# EAGLE design CAN Mirror_backup_NOTCURRENT (EAGLE 5.12)
PARTNO: SDR0604-180YL

## Sheet 1 of 3
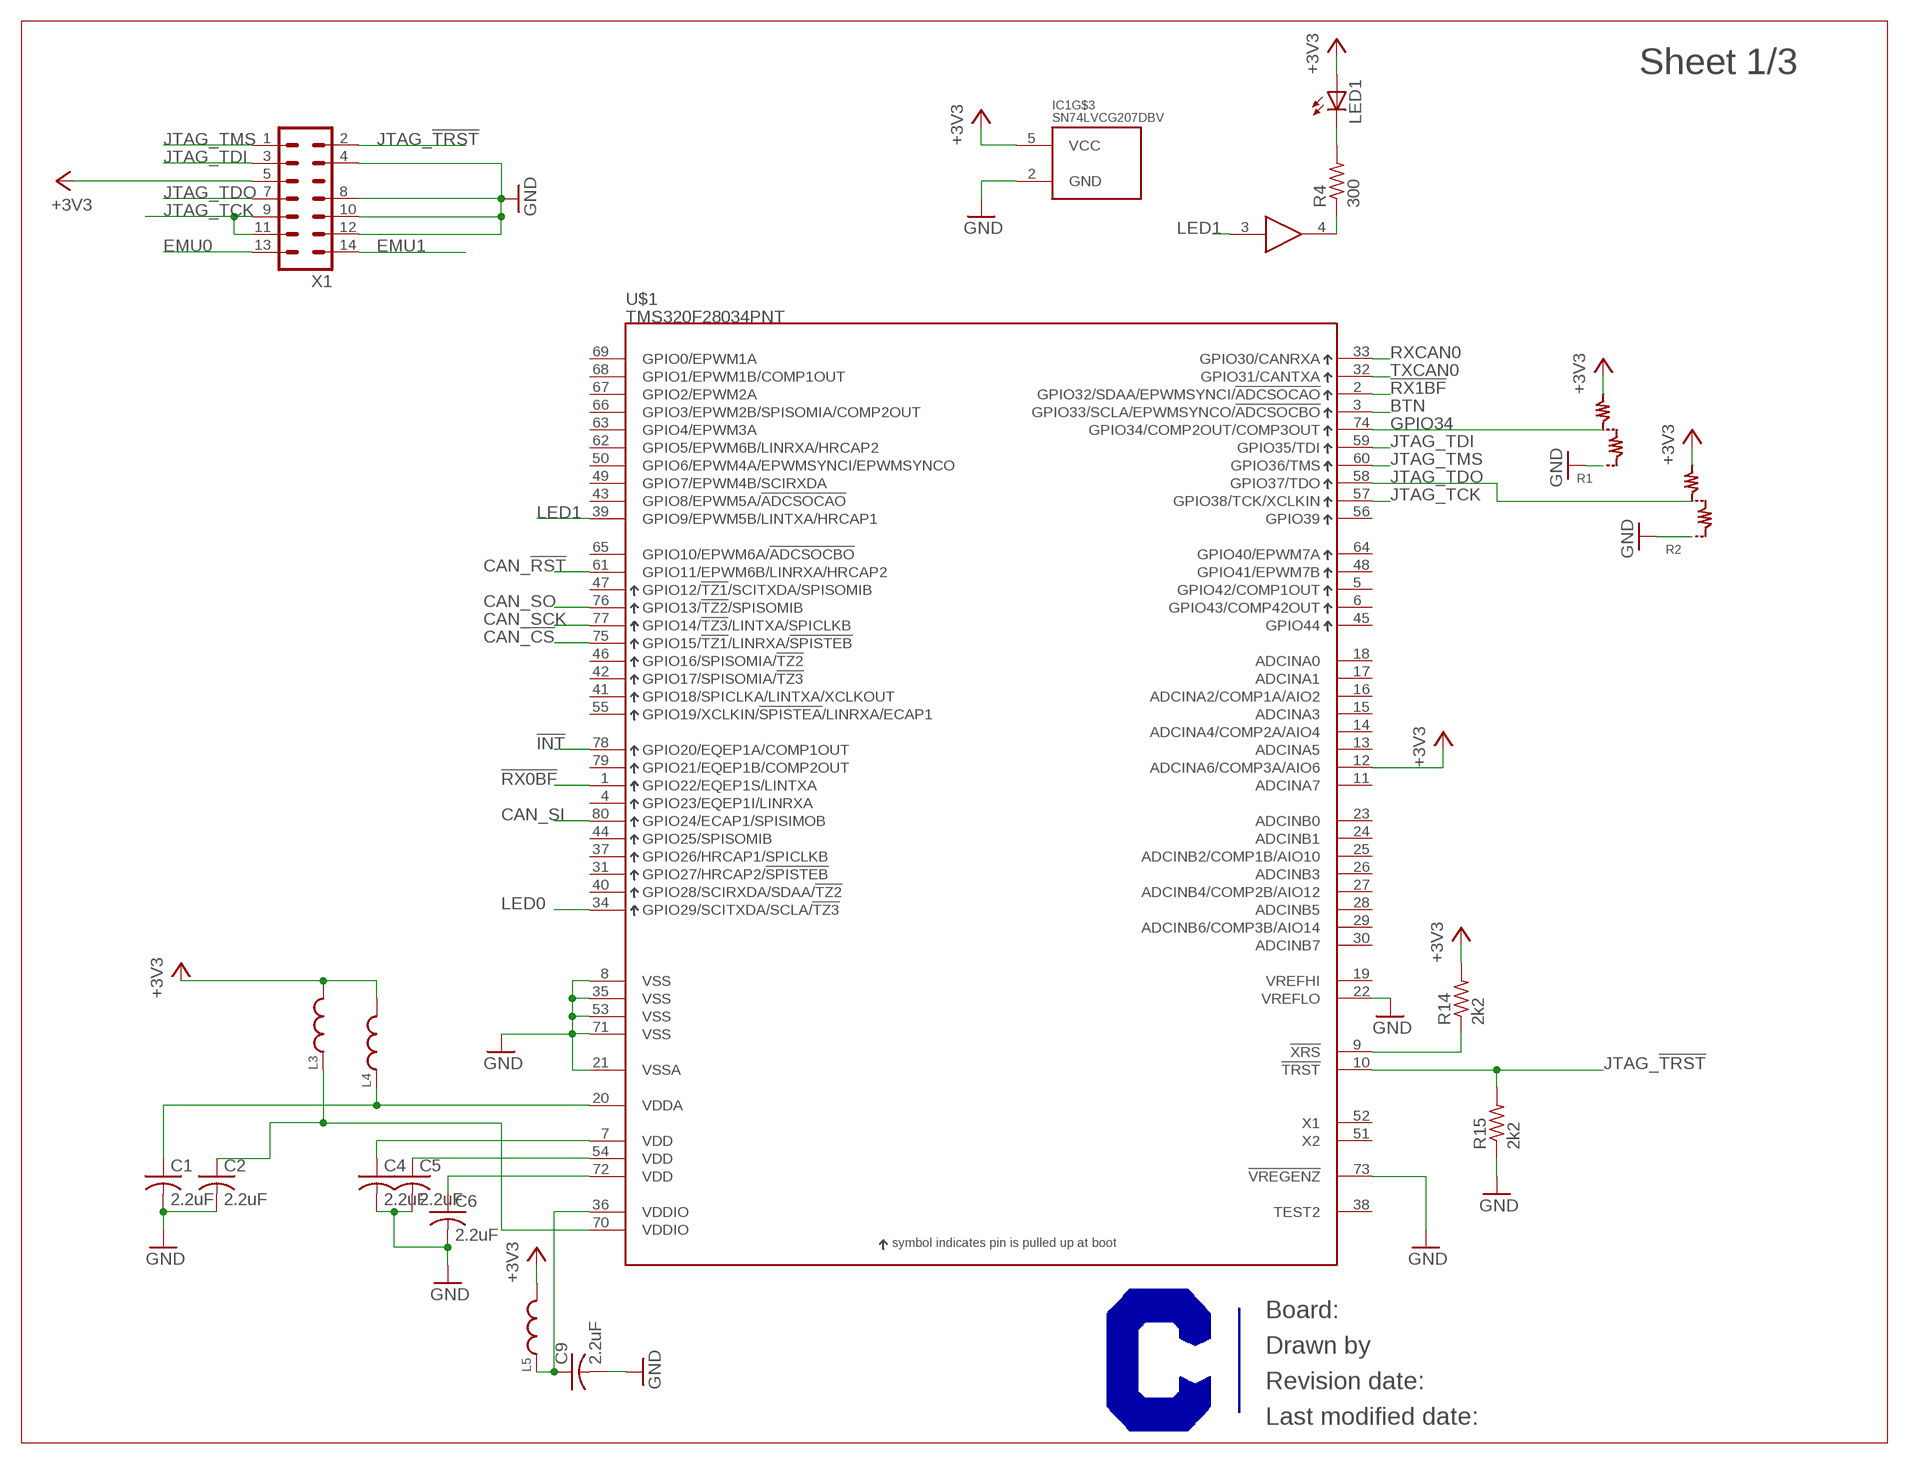
[diagram p0: schematic, sheet 1]

### Parts
C1  2.2uF  C-USC0603  [C0603]
C2  2.2uF  C-USC0603  [C0603]
C4  2.2uF  C-USC0603  [C0603]
C5  2.2uF  C-USC0603  [C0603]
C6  2.2uF  C-USC0603  [C0603]
C9  2.2uF  C-USC0603  [C0603]
IC1  SN74LVCG207DBV  [DBV_(R-PDSO-G6)]
L3  INDUCTOR  [0603]
L4  INDUCTOR  [0603]
L5  INDUCTOR  [0603]
LED1  SMS1105  [SMS1105]
R1  0402-JUMPER-3WAY-0603  [0603-JUMPER-3WAY]
R2  0402-JUMPER-3WAY-0603  [0603-JUMPER-3WAY]
R4  300  R-US_R0603  [R0603]
R14  2k2  R-US_R0603  [R0603]
R15  2k2  R-US_R0603  [R0603]
U$1  TMS320F28034PNT  [PQFP-80_(S-PQFP-G80)]
U$2  CURRENT-C-LETTER-LANDSCAPE  [BLANK]
X1  JTAG_HEADER  [TI_JTAG_HEADER]

### Nets
!INT: U$1.78(GPIO20/EQEP1A/COMP1OUT) ; also sheet 2
!RX0BF: U$1.1(GPIO22/EQEP1S/LINTXA) ; also sheet 2
!RX1BF: U$1.2(GPIO32/SDAA/EPWMSYNCI/!ADCSOCAO) ; also sheet 2
+3V3: IC1.5(VCC) L3.B L4.B L5.B LED1.ANODE(A) R1.B R2.B R14.2 U$1.12(ADCINA6/COMP3A/AIO6) X1.5(VTREF) ; also sheet 2,3
BTN: U$1.3(GPIO33/SCLA/EPWMSYNCO/!ADCSOCBO)
CAN_!CS: U$1.75(GPIO15/!TZ1!/LINRXA/!SPISTEB)
CAN_!RST: U$1.61(GPIO11/EPWM6B/LINRXA/HRCAP2)
CAN_SCK: U$1.77(GPIO14/!TZ3!/LINTXA/SPICLKB)
CAN_SI: U$1.80(GPIO24/ECAP1/SPISIMOB)
CAN_SO: U$1.76(GPIO13/!TZ2!/SPISOMIB)
EMU0: X1.13(EMU0)
EMU1: X1.14(EMU1)
GND: C1.2 C2.2 C4.2 C5.2 C6.2 C9.2 IC1.2(GND) R1.C R2.C R15.1 U$1.8(VSS) U$1.21(VSSA) U$1.22(VREFLO) U$1.35(VSS) U$1.53(VSS) U$1.71(VSS) U$1.73(!VREGENZ) X1.4(GND) X1.8(GND) X1.10(GND) X1.12(GND) ; also sheet 2,3
GPIO34: R1.A U$1.74(GPIO34/COMP2OUT/COMP3OUT)
JTAG_!TRST: R15.2 U$1.10(!TRST) X1.2(!TRST)
JTAG_TCK: U$1.57(GPIO38/TCK/XCLKIN) X1.9(TCK) X1.11
JTAG_TDI: U$1.59(GPIO35/TDI) X1.3(TDI)
JTAG_TDO: R2.A U$1.58(GPIO37/TDO) X1.7(TDO)
JTAG_TMS: U$1.60(GPIO36/TMS) X1.1(TMS)
LED0: U$1.34(GPIO29/SCITXDA/SCLA/!TZ3)
LED1: IC1.3(A) U$1.39(GPIO9/EPWM5B/LINTXA/HRCAP1)
N$1: R14.1 U$1.9(!XRS)
N$2: C1.1 L4.A U$1.20(VDDA)
N$3: C2.1 L3.A U$1.70(VDDIO)
N$4: IC1.4(Y) R4.1
N$5: C6.1 U$1.72(VDD)
N$6: C5.1 U$1.54(VDD)
N$7: C4.1 U$1.7(VDD)
N$9: LED1.CATHODE(C) R4.2
N$10: C9.1 L5.A U$1.36(VDDIO)
RXCAN0: U$1.33(GPIO30/CANRXA) ; also sheet 2
TXCAN0: U$1.32(GPIO31/CANTXA) ; also sheet 2
Unconnected: IC1.1(A) IC1.6(Y) U$1.4(GPIO23/EQEP1I/LINRXA) U$1.5(GPIO42/COMP1OUT) U$1.6(GPIO43/COMP42OUT) U$1.11(ADCINA7) U$1.13(ADCINA5) U$1.14(ADCINA4/COMP2A/AIO4) U$1.15(ADCINA3) U$1.16(ADCINA2/COMP1A/AIO2) U$1.17(ADCINA1) U$1.18(ADCINA0) U$1.19(VREFHI) U$1.23(ADCINB0) U$1.24(ADCINB1) U$1.25(ADCINB2/COMP1B/AIO10) U$1.26(ADCINB3) U$1.27(ADCINB4/COMP2B/AIO12) U$1.28(ADCINB5) U$1.29(ADCINB6/COMP3B/AIO14) U$1.30(ADCINB7) U$1.31(GPIO27/HRCAP2/!SPISTEB) U$1.37(GPIO26/HRCAP1/SPICLKB) U$1.38(TEST2) U$1.40(GPIO28/SCIRXDA/SDAA/!TZ2) U$1.41(GPIO18/SPICLKA/LINTXA/XCLKOUT) U$1.42(GPIO17/SPISOMIA/!TZ3) U$1.43(GPIO8/EPWM5A/!ADCSOCAO) U$1.44(GPIO25/SPISOMIB) U$1.45(GPIO44) U$1.46(GPIO16/SPISOMIA/!TZ2) U$1.47(GPIO12/!TZ1!/SCITXDA/SPISOMIB) U$1.48(GPIO41/EPWM7B) U$1.49(GPIO7/EPWM4B/SCIRXDA) U$1.50(GPIO6/EPWM4A/EPWMSYNCI/EPWMSYNCO) U$1.51(X2) U$1.52(X1) U$1.55(GPIO19/XCLKIN/!SPISTEA!/LINRXA/ECAP1) U$1.56(GPIO39) U$1.62(GPIO5/EPWM6B/LINRXA/HRCAP2) U$1.63(GPIO4/EPWM3A) U$1.64(GPIO40/EPWM7A) U$1.65(GPIO10/EPWM6A/!ADCSOCBO) U$1.66(GPIO3/EPWM2B/SPISOMIA/COMP2OUT) U$1.67(GPIO2/EPWM2A) U$1.68(GPIO1/EPWM1B/COMP1OUT) U$1.69(GPIO0/EPWM1A) U$1.79(GPIO21/EQEP1B/COMP2OUT)

## Sheet 2 of 3
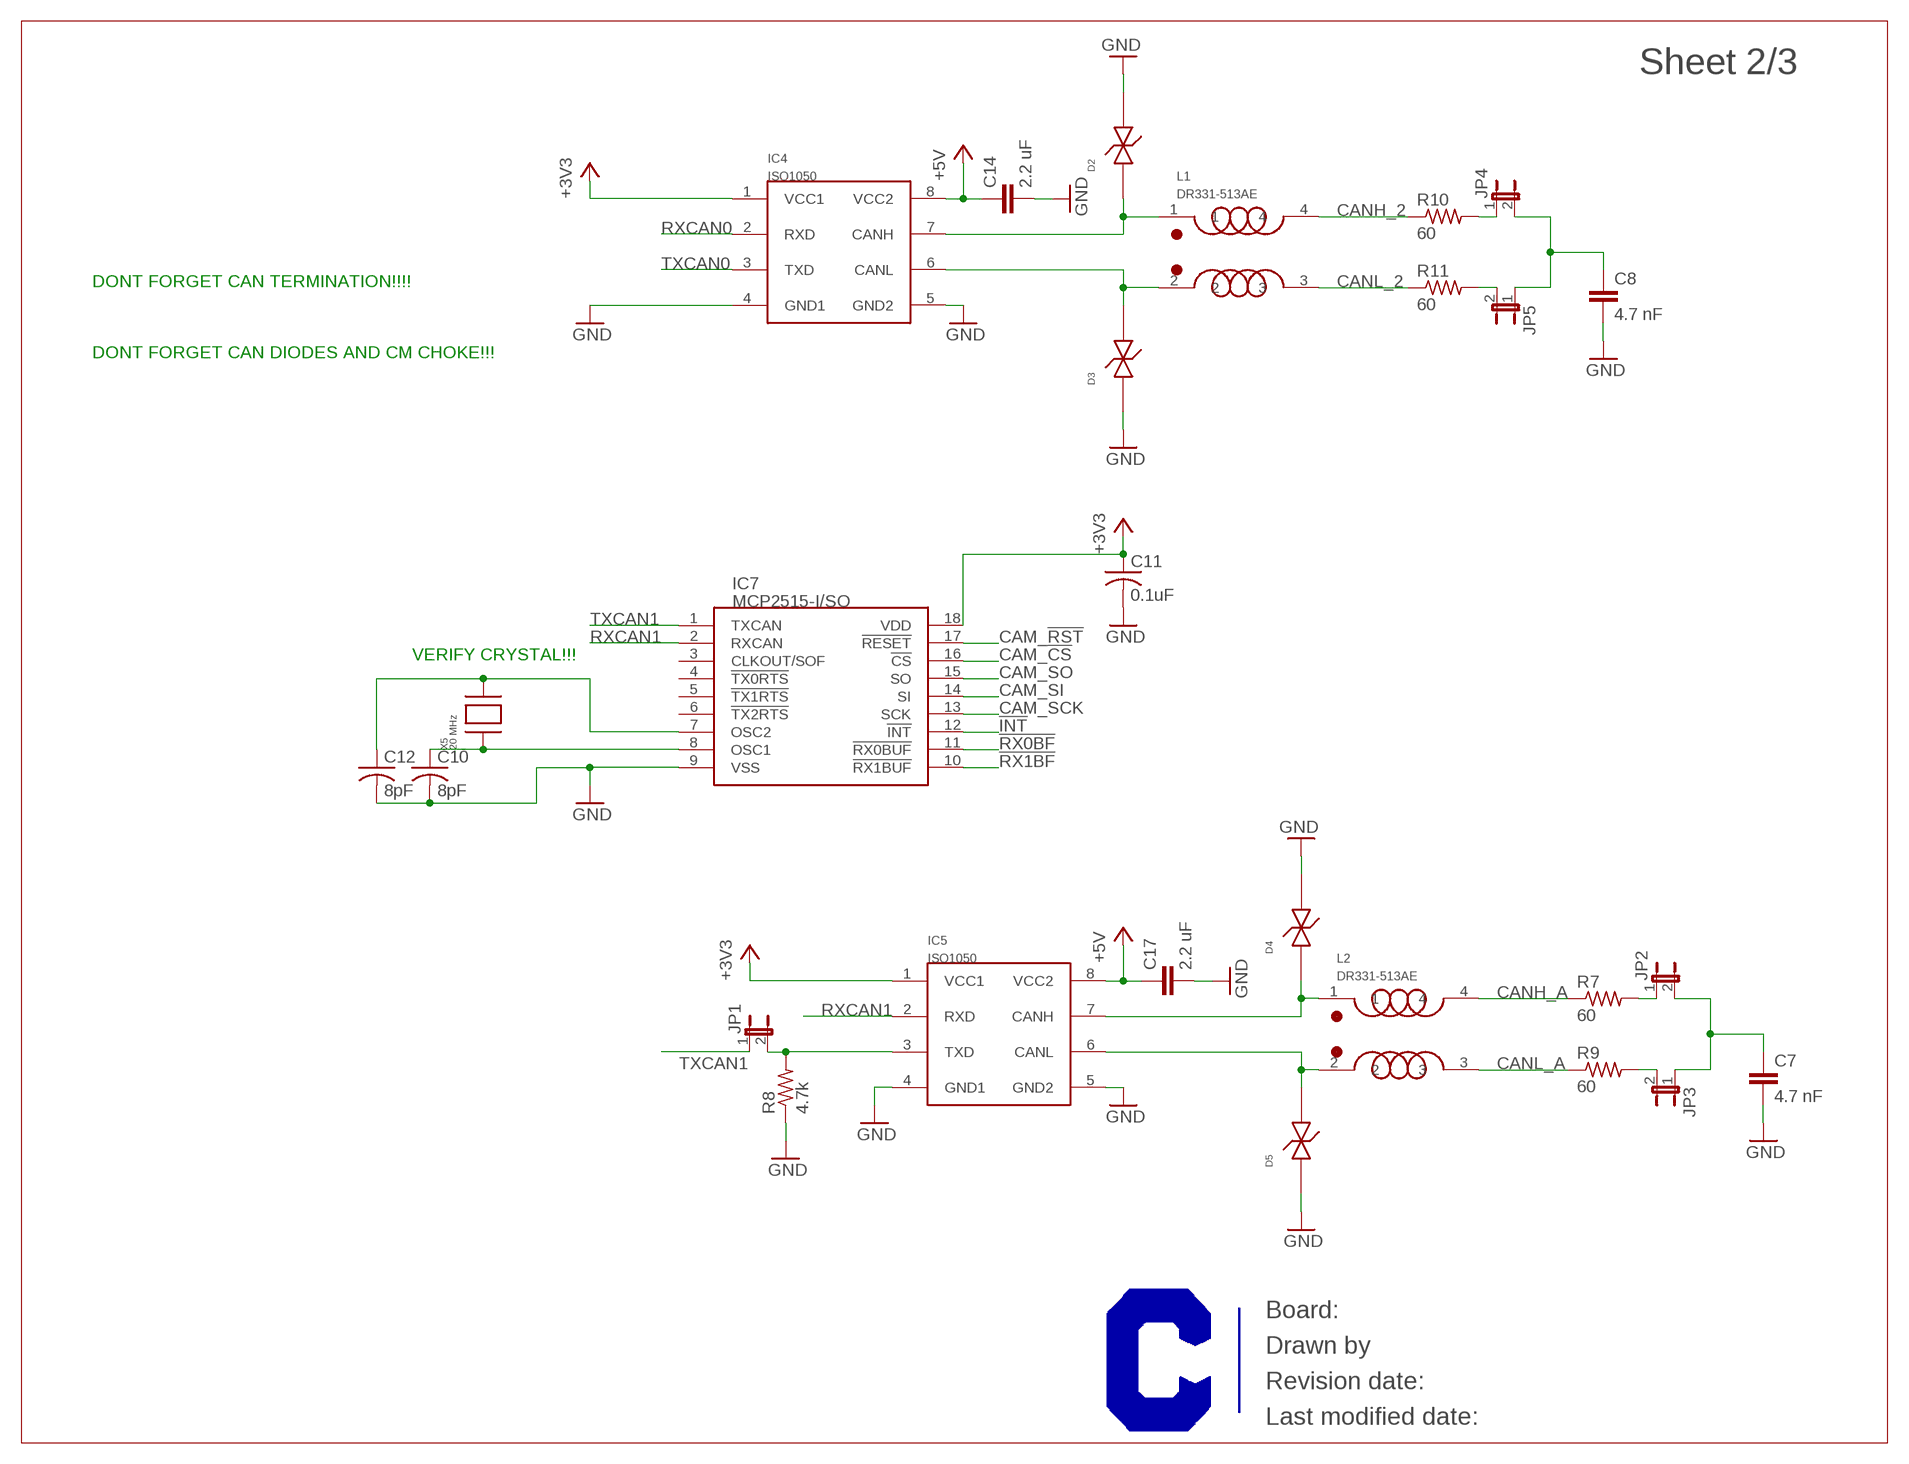
[diagram p1: schematic, sheet 2]

### Parts
C7  4.7 nF  C-EUC0603  [C0603]
C8  4.7 nF  C-EUC0603  [C0603]
C10  8pF  C-USC0603  [C0603]
C11  0.1uF  C-USC0603  [C0603]
C12  8pF  C-USC0603  [C0603]
C14  2.2 uF  C-EUC0603  [C0603]
C17  2.2 uF  C-EUC0603  [C0603]
D2  SMBJ30CA  [DO-214AA]
D3  SMBJ30CA  [DO-214AA]
D4  SMBJ30CA  [DO-214AA]
D5  SMBJ30CA  [DO-214AA]
IC4  ISO1050  [DUB_(R-PDSO-G8)]
IC5  ISO1050  [DUB_(R-PDSO-G8)]
IC7  MCP2515-I/SO  [SOIC18]
JP1  JP1E  [JP1]
JP2  JP1E  [JP1]
JP3  JP1E  [JP1]
JP4  JP1E  [JP1]
JP5  JP1E  [JP1]
L1  DR331-513AE  [SMD]
L2  DR331-513AE  [SMD]
R7  60  R-US_R0603  [R0603]
R8  4.7k  R-US_R0603  [R0603]
R9  60  R-US_R0603  [R0603]
R10  60  R-US_R0603  [R0603]
R11  60  R-US_R0603  [R0603]
U$5  CURRENT-C-LETTER-LANDSCAPE  [BLANK]
X5  20 MHz  ECX53B  [ECX-53B]

### Nets
!INT: IC7.12(!INT) ; also sheet 1
!RX0BF: IC7.11(!RX0BUF) ; also sheet 1
!RX1BF: IC7.10(!RX1BUF) ; also sheet 1
+3V3: C11.1 IC4.1(VCC1) IC5.1(VCC1) IC7.18(VDD) ; also sheet 1,3
+5V: C14.1 C17.1 IC4.8(VCC2) IC5.8(VCC2) ; also sheet 3
CAM_!CS: IC7.16(!CS)
CAM_!RST: IC7.17(!RESET)
CAM_SCK: IC7.13(SCK)
CAM_SI: IC7.14(SI)
CAM_SO: IC7.15(SO)
CANH_2: L1.4 R10.1 ; also sheet 3
CANH_2_NF: D2.1 IC4.7(CANH) L1.1
CANH_A: L2.4 R7.1 ; also sheet 3
CANH_A_NF: D4.1 IC5.7(CANH) L2.1
CANL_2: L1.3 R11.1 ; also sheet 3
CANL_2_NF: D3.2 IC4.6(CANL) L1.2
CANL_A: L2.3 R9.1 ; also sheet 3
CANL_A_NF: D5.2 IC5.6(CANL) L2.2
GND: C7.2 C8.2 C10.2 C11.2 C12.2 C14.2 C17.2 D2.2 D3.1 D4.2 D5.1 IC4.4(GND1) IC4.5(GND2) IC5.4(GND1) IC5.5(GND2) IC7.9(VSS) R8.1 ; also sheet 1,3
N$12: JP2.1 R7.2
N$13: JP3.2 R9.2
N$14: C7.1 JP2.2 JP3.1
N$15: JP4.1 R10.2
N$16: JP5.2 R11.2
N$17: C8.1 JP4.2 JP5.1
N$24: C10.1 IC7.8(OSC1) X5.1
N$25: C12.1 IC7.7(OSC2) X5.3
RXCAN0: IC4.2(RXD) ; also sheet 1
RXCAN1: IC5.2(RXD) IC7.2(RXCAN)
TXCAN0: IC4.3(TXD) ; also sheet 1
TXCAN1: IC7.1(TXCAN) JP1.1
TXCAN_NJ: IC5.3(TXD) JP1.2 R8.2
Unconnected: IC7.3(CLKOUT/SOF) IC7.4(!TX0RTS) IC7.5(!TX1RTS) IC7.6(!TX2RTS)

### Notes on the sheet
- DONT FORGET CAN TERMINATION!!!!
- DONT FORGET CAN DIODES AND CM CHOKE!!!
- VERIFY CRYSTAL!!!

## Sheet 3 of 3
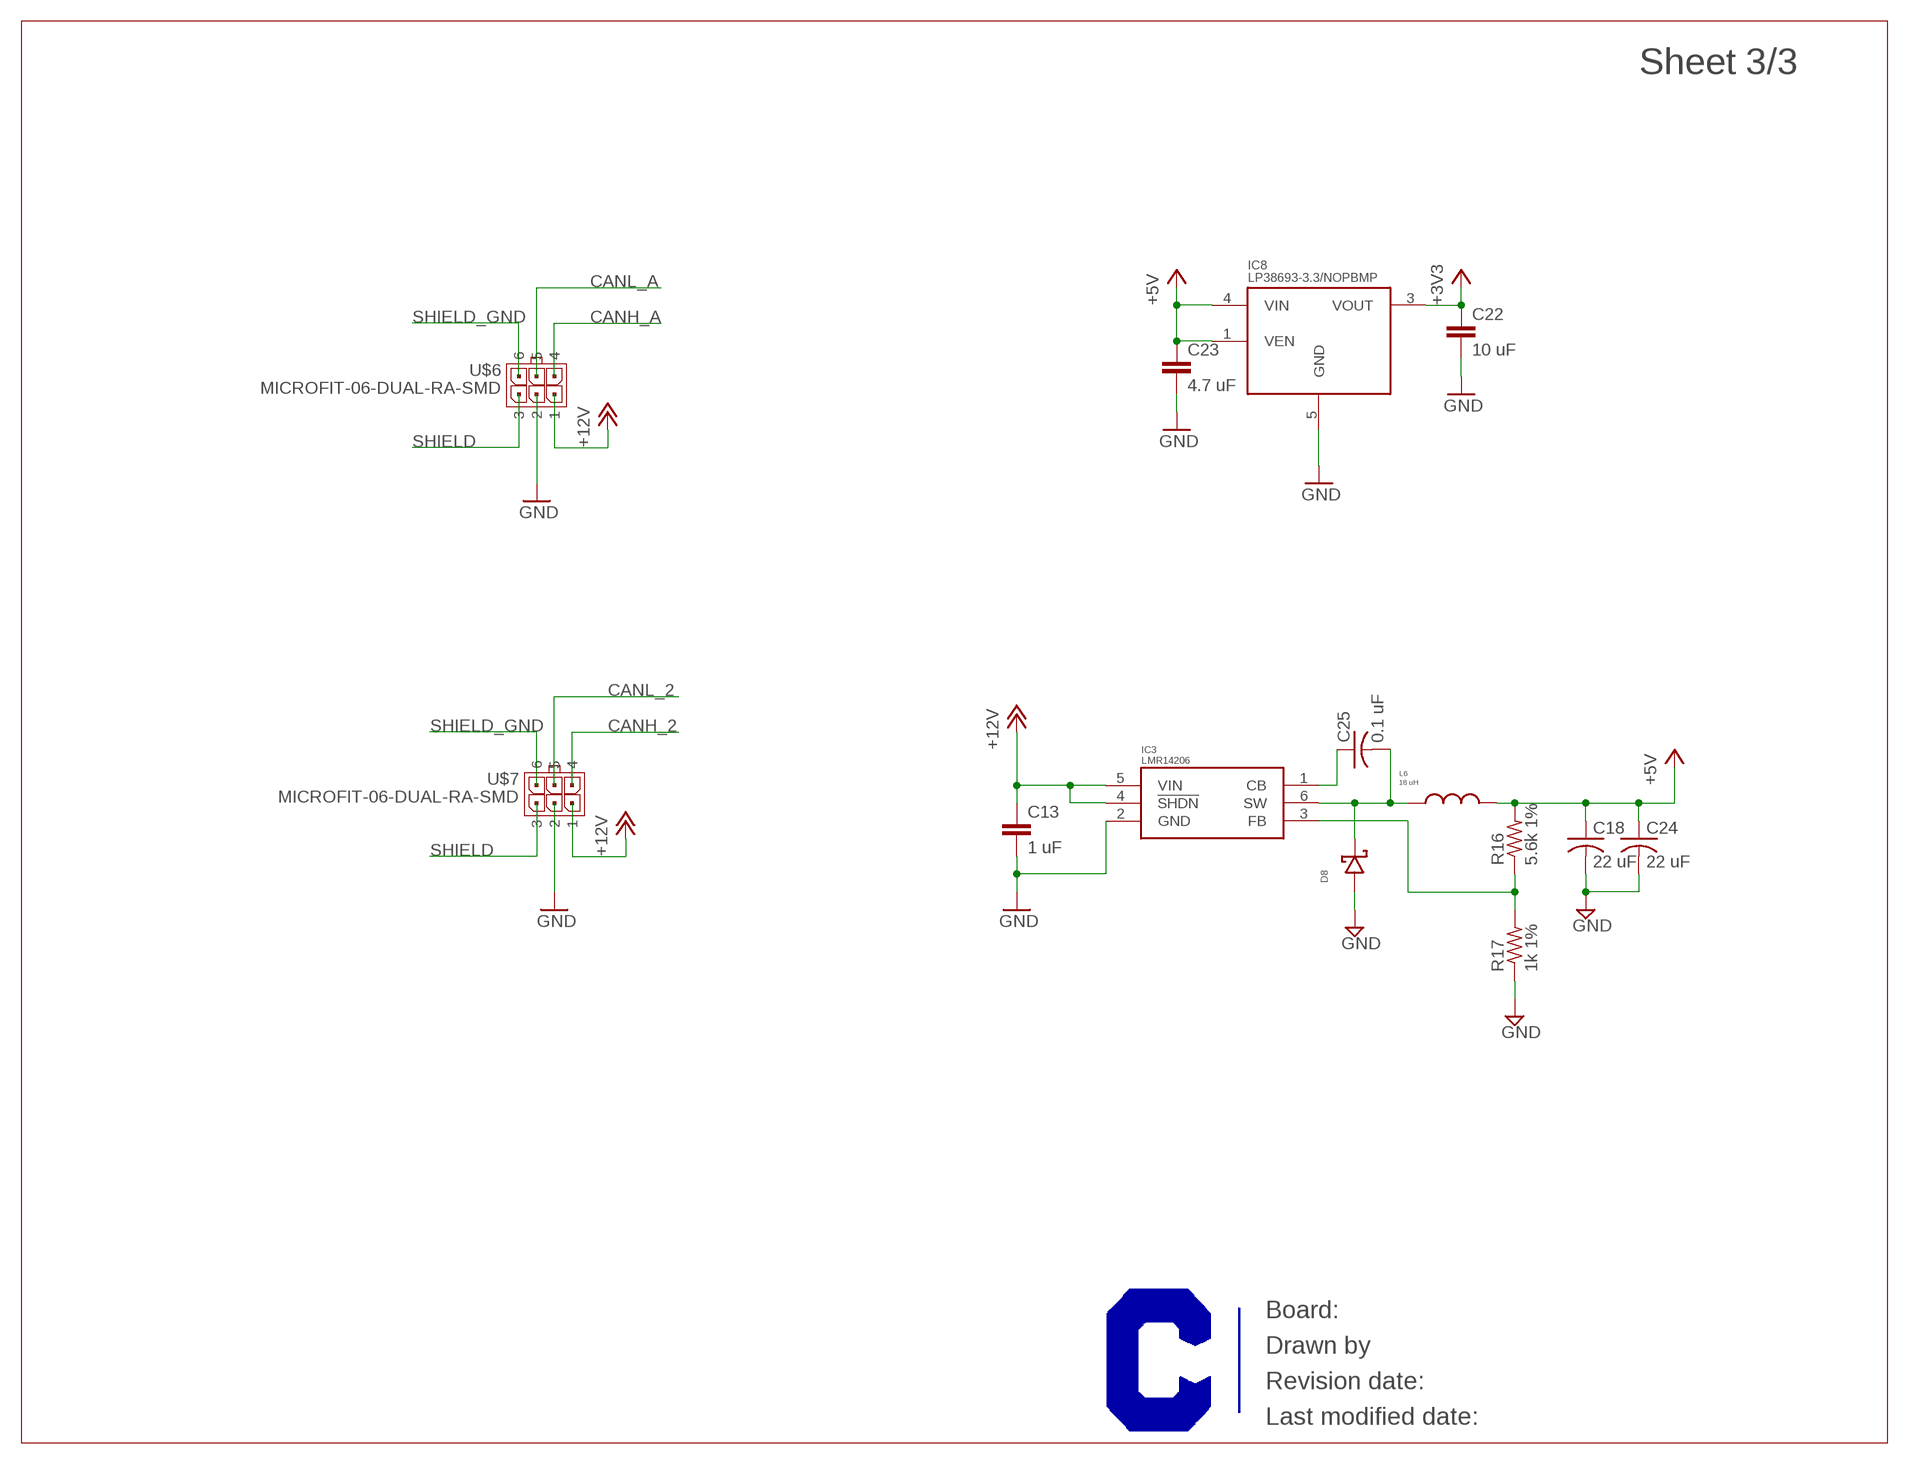
[diagram p2: schematic, sheet 3]

### Parts
C13  1 uF  C-EUC1206  [C1206]
C18  22 uF  C-USC0805  [C0805]
C22  10 uF  C-EUC0603  [C0603]
C23  4.7 uF  C-EUC0603  [C0603]
C24  22 uF  C-USC0805  [C0805]
C25  0.1 uF  C-USC0603  [C0603]
D8  SCHOTTKY_DIODE-SMA  [SMA]
IC3  LMR14206  [SOT-6_DDC]
IC8  LP38693-3.3/NOPBMP  [SOT-223-5]
L6  18 uH  VLP8040T  [VLP8040]
R16  5.6k 1%  R-US_R0603  [R0603]
R17  1k 1%  R-US_R0603  [R0603]
U$3  CURRENT-C-LETTER-LANDSCAPE  [BLANK]
U$6  MICROFIT-06-DUAL-RA-SMD  [MICROFIT-6-DUAL-RA-SMD]
U$7  MICROFIT-06-DUAL-RA-SMD  [MICROFIT-6-DUAL-RA-SMD]

### Nets
+3V3: C22.1 IC8.3(VOUT) ; also sheet 1,2
+5V: C18.1 C23.1 C24.1 IC8.1(VEN) IC8.4(VIN) L6.2 R16.2 ; also sheet 2
+12V: C13.1 IC3.4(!SHDN) IC3.5(VIN) U$6.6 U$7.6
CANH_2: U$7.1 ; also sheet 2
CANH_A: U$6.1 ; also sheet 2
CANL_2: U$7.2 ; also sheet 2
CANL_A: U$6.2 ; also sheet 2
GND: C13.2 C18.2 C22.2 C23.2 C24.2 D8.ANODE IC3.2(GND) IC8.5(GND) R17.1 U$6.5 U$7.5 ; also sheet 1,2
N$21: C25.2 D8.CATHODE IC3.6(SW) L6.1
N$22: C25.1 IC3.1(CB)
SHIELD: U$6.4 U$7.4
SHIELD_GND: U$6.3 U$7.3
VSENSE1: IC3.3(FB) R16.1 R17.2

## Library data of the parts
C1 C2 C4-C6 C9-C12 C18 C24 C25 = rcl:C-US: CAPACITOR, American symbol
C7 C8 C13 C14 C17 C22 C23 = rcl:C-EU: CAPACITOR, European symbol
D2-D5 = Littelfuse:SMBJ30CA: Bidirectional TVS Zener Diode 30V Breakdown http://www.digikey.com/product-detail/en/SMBJ30CA/SMBJ30CALFCT-ND/286112; PARTNO: SMBJ30CALFCT-ND
D8 = Diodes:SCHOTTKY_DIODE
IC1 = TI:SN74LVCG207: SN74LVC2G07: Dual Buffer/Driver with Open Drain Outputs no datasheet 4 u!!
IC3 = TI:LMR14206: LMR14206 SIMPLE SWITCHER® 42Vin, 0.6A Step-Down Voltage Regulator in SOT-23 Datasheet: http://www.ti.com/lit/ds/symlink/lmr14206.pdf
IC4 IC5 = TI:ISO1050: ISO1050 - Isolated 5V CAN Transceiver w/ 3.3V or 5V Logic http://www.ti.com/product/iso1050; PARTNO: ISO1050DUBR
IC7 = Microchip:MCP2515: Stand alone CAN controller with SPI interface; PARTNO: MCP2515-I/SO
IC8 = TI:LP38693: TI LP38693-3.3 LDO 500mA Very Low Vdo. http://www.ti.com/lit/ds/symlink/lp38693.pdf; PARTNO: LP38693MP-3.3/NOPB
JP1-JP5 = jumper:JP1E: JUMPER
L1 L2 = Bourns:DR331-513AE: Bourns Common Mode Choke; PARTNO: DR331-513AECT-ND
L3-L5 = Passives:INDUCTOR
L6 = TDK:VLP: VLP Series Shielded Wound Ferrite Inductors Datasheet: http://datasheet.octopart.com/VLP8040T-100M-TDK-datasheet-16646286.pdf
LED1 = Bivar:SMS1105: Bivar SMS1105PGC Side View Package LED Datasheet: http://datasheet.octopart.com/SMS1105PGC-Bivar-datasheet-8780798.pdf
R1 R2 = Passives:0402-JUMPER-3WAY: A 3-way solder jumper in 0402 size.
R4 R7-R11 R14-R17 = rcl:R-US_: RESISTOR, American symbol
U$1 = TI:TMS320F28034: TMS320F2803x (Piccolo) 32-Bit High-Efficiency MCU Datasheet: http://www.ti.com/lit/ds/sprs584j/sprs584j.pdf Product page: http://www.ti.com/product/tms320f28034; PARTNO: TMS320F28035PNT
U$2 U$3 U$5 = Frames:CURRENT-C-LETTER-LANDSCAPE; BOM: EXCLUDE
U$6 U$7 = Molex:MICROFIT-06-DUAL: Molex MicroFit 3.00mm Pitch Header, Surface Mount, Dual Row, 6 Circuits Molex P/N: 43045-0609 (right-angle) 43045-0618 (vertical) RA: Drawing: http://www.molex.com/pdm_docs/sd/430450609_sd.pdf (right-angle) Information: http://www.molex.com/molex/products/datasheet.jsp?part=active/0430450618_PCB_HEADERS.xml
X1 = TI:JTAG_HEADER: TI 14-pin JTAG header Reference: http://processors.wiki.ti.com/index.php/JTAG_Connectors
X5 = Crystals:ECX53B: ECX-53B SMD Quartz Crystal Datasheet: http://www.ecsxtal.com/store/pdf/ecx_53b.pdf

## Board
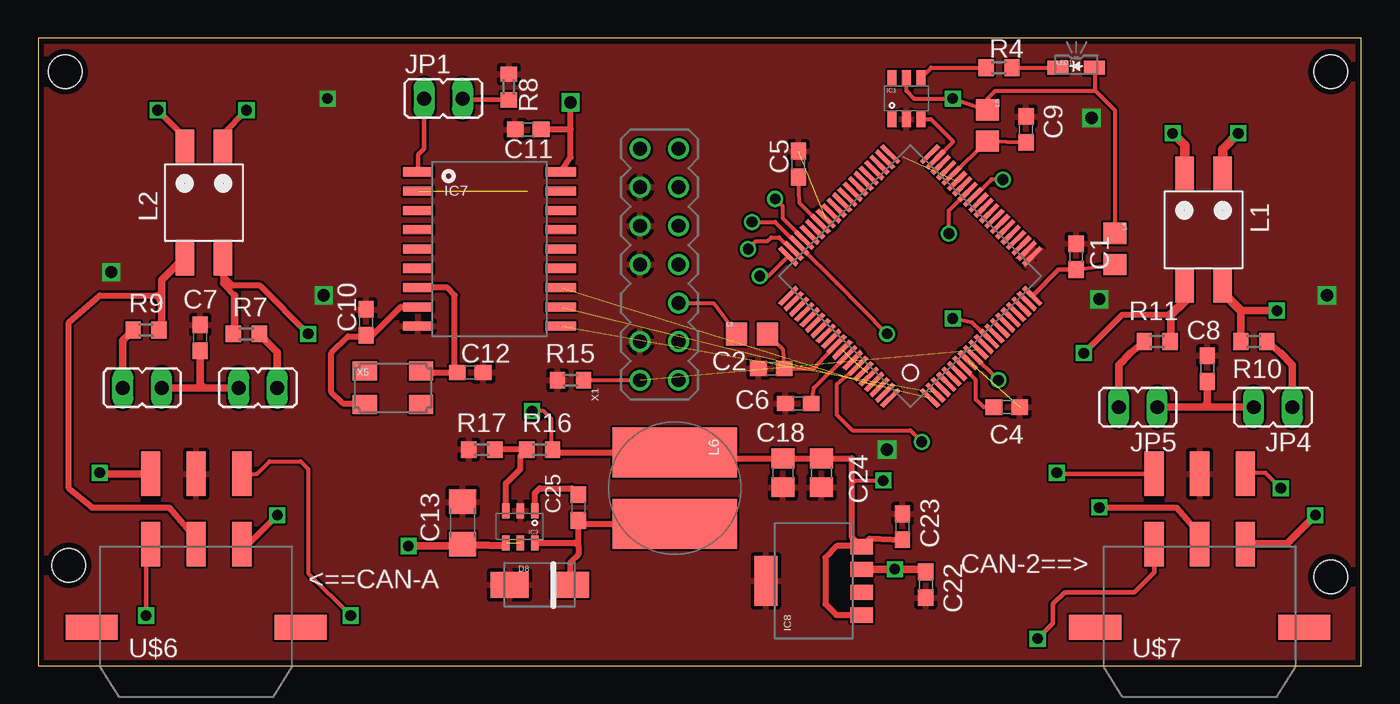
[diagram p3: board, top side]
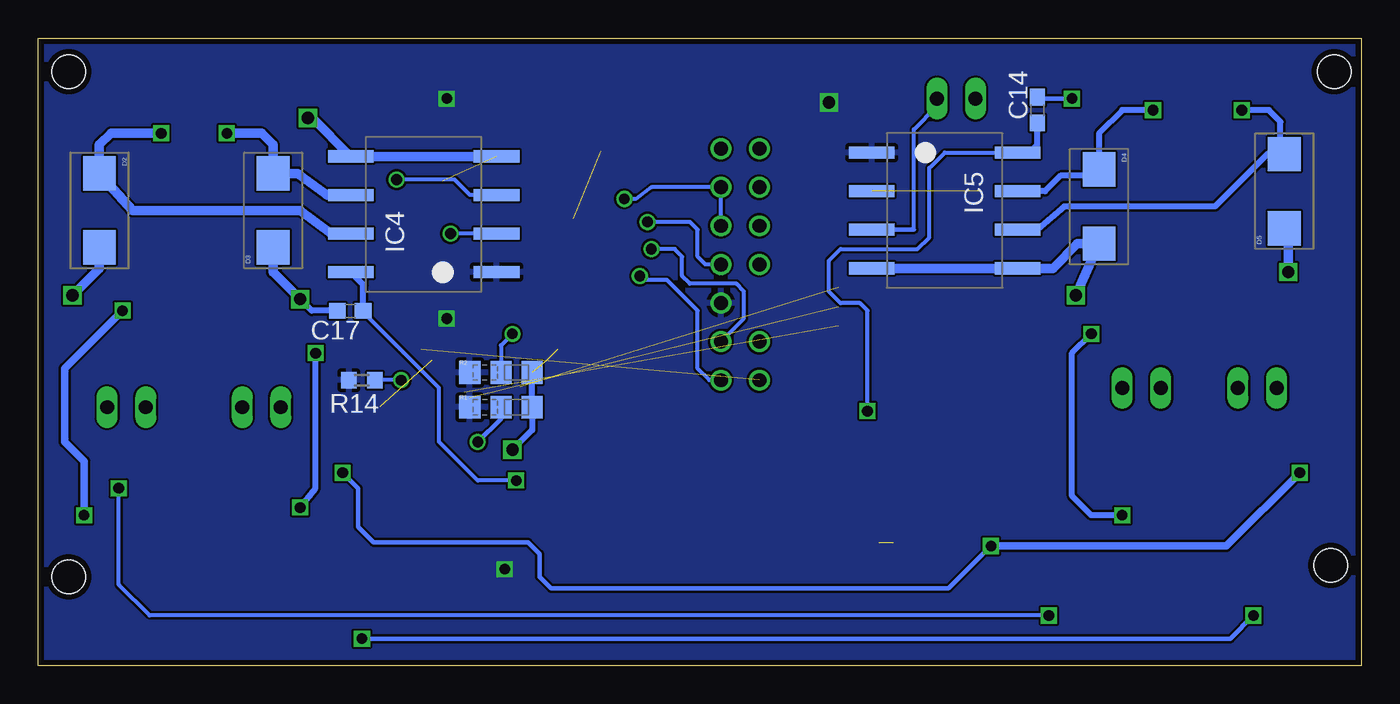
[diagram p4: board, bottom side, seen from below]

Size 87.1 x 41.33 mm. Coordinates in mm from the lower left corner, seen from the top.
Outline: 0,0 87.1,0 87.1,41.33 0,41.33 0,0
Copper layers (1*16): Top 0.0356mm / dielectric 1.5011mm / Bottom 0.0356mm
Design rules "OSH Park 2-layer": minimum track width 6mil, minimum drill 13mil, track to track 6mil, track to pad 6mil, pad to pad 6mil, via to via 6mil, smd to smd 6mil, copper to edge 15mil, drill to drill 6mil, minimum pad ring 7mil, minimum via ring 7mil, stop-mask expansion 4mil, vias tented up to drill 0mil, thermal gap 10mil
Holes 2.2 mm at 1.78,39.12 85.09,39.12 85.09,5.84 2.03,6.6

### Footprints (pad centres in the part's own frame; a part is rotated, then mirrored left to right if it is on the bottom)
C0603 = smd 1.1 x 1: 1 -0.85,0; 2 0.85,0
C1206 = smd 1.6 x 1.8: 1 -1.4,0; 2 1.4,0
C0805 = smd 1.3 x 1.5: 1 -0.95,0; 2 0.95,0
DO-214AA = smd 2.261 x 2.159: 1 -2.438,0; 2 2.438,0
SMA = smd 2.5 x 1.7: ANODE -2,0; CATHODE 2,0
DBV_(R-PDSO-G6) = smd 0.6 x 1.05: 1 -0.95,-1.35; 2 0,-1.35; 3 0.95,-1.35; 4 0.95,1.35; 5 0,1.35; 6 -0.95,1.35
SOT-6_DDC = smd 0.5 x 1: 1 -0.95,-1.05; 2 0,-1.05; 3 0.95,-1.05; 4 0.95,1.05; 5 0,1.05; 6 -0.95,1.05
DUB_(R-PDSO-G8) = smd 0.8 x 3: 1 -3.81,-4.8; 2 -1.27,-4.8; 3 1.27,-4.8; 4 3.81,-4.8; 5 3.81,4.8; 6 1.27,4.8; 7 -1.27,4.8; 8 -3.81,4.8
SOIC18 = smd 0.6 x 2: 1 -5.08,-4.7; 2 -3.81,-4.7; 3 -2.54,-4.7; 4 -1.27,-4.7; 5 0,-4.7; 6 1.27,-4.7; 7 2.54,-4.7; 8 3.81,-4.7; 9 5.08,-4.7; 10 5.08,4.7; 11 3.81,4.7; 12 2.54,4.7; 13 1.27,4.7; 14 0,4.7; 15 -1.27,4.7; 16 -2.54,4.7; 17 -3.81,4.7; 18 -5.08,4.7
SOT-223-5 = smd 1 x 1.5: 1 -2.25,-3.15; 2 -0.75,-3.15; 3 0.75,-3.15; 4 2.25,-3.15 | smd 3.3 x 1.5: 5 0,3.15
JP1 = drill 0.914 long: 1 0,-1.27; 2 0,1.27
SMD = smd 2.21 x 1.2: 1 -3.7,1.25; 2 -3.7,-1.25; 3 3.7,-1.25; 4 3.7,1.25
0603 = smd 1.4 x 1.5: A 1.025,0; B -1.025,0
VLP8040 = smd 3.3 x 8.2: 1 2.35,0; 2 -2.35,0
SMS1105 = smd 1.4 x 0.9: ANODE 1.2,0; CATHODE -1.2,0
0603-JUMPER-3WAY = smd 1.4 x 1.5: A 1.025,0; B -1.025,0; C 3.075,0
R0603 = smd 1 x 1.1: 1 -0.85,0; 2 0.85,0
PQFP-80_(S-PQFP-G80) = smd 0.3 x 1.6: 1 -4.75,-6.6; 2 -4.25,-6.6; 3 -3.75,-6.6; 4 -3.25,-6.6; 5 -2.75,-6.6; 6 -2.25,-6.6; 7 -1.75,-6.6; 8 -1.25,-6.6; 9 -0.75,-6.6; 10 -0.25,-6.6; 11 0.25,-6.6; 12 0.75,-6.6; 13 1.25,-6.6; 14 1.75,-6.6; 15 2.25,-6.6; 16 2.75,-6.6; 17 3.25,-6.6; 18 3.75,-6.6; 19 4.25,-6.6; 20 4.75,-6.6; 41 4.75,6.6; 42 4.25,6.6; 43 3.75,6.6; 44 3.25,6.6; 45 2.75,6.6; 46 2.25,6.6; 47 1.75,6.6; 48 1.25,6.6; 49 0.75,6.6; 50 0.25,6.6; 51 -0.25,6.6; 52 -0.75,6.6; 53 -1.25,6.6; 54 -1.75,6.6; 55 -2.25,6.6; 56 -2.75,6.6; 57 -3.25,6.6; 58 -3.75,6.6; 59 -4.25,6.6; 60 -4.75,6.6 | smd 1.6 x 0.3: 21 6.6,-4.75; 22 6.6,-4.25; 23 6.6,-3.75; 24 6.6,-3.25; 25 6.6,-2.75; 26 6.6,-2.25; 27 6.6,-1.75; 28 6.6,-1.25; 29 6.6,-0.75; 30 6.6,-0.25; 31 6.6,0.25; 32 6.6,0.75; 33 6.6,1.25; 34 6.6,1.75; 35 6.6,2.25; 36 6.6,2.75; 37 6.6,3.25; 38 6.6,3.75; 39 6.6,4.25; 40 6.6,4.75; 61 -6.6,4.75; 62 -6.6,4.25; 63 -6.6,3.75; 64 -6.6,3.25; 65 -6.6,2.75; 66 -6.6,2.25; 67 -6.6,1.75; 68 -6.6,1.25; 69 -6.6,0.75; 70 -6.6,0.25; 71 -6.6,-0.25; 72 -6.6,-0.75; 73 -6.6,-1.25; 74 -6.6,-1.75; 75 -6.6,-2.25; 76 -6.6,-2.75; 77 -6.6,-3.25; 78 -6.6,-3.75; 79 -6.6,-4.25; 80 -6.6,-4.75
MICROFIT-6-DUAL-RA-SMD = smd 1.27 x 2.921: 1 3,5.47; 2 0,5.47; 3 -3,5.47; 4 3,10.1; 5 0,10.1; 6 -3,10.1 | smd 3.429 x 1.651: P$9 6.883,0; P$10 -6.883,0
TI_JTAG_HEADER = drill 0.914 round: 1 -7.62,-1.27; 2 -7.62,1.27; 3 -5.08,-1.27; 4 -5.08,1.27; 5 -2.54,-1.27; 7 0,-1.27; 8 0,1.27; 9 2.54,-1.27; 10 2.54,1.27; 11 5.08,-1.27; 12 5.08,1.27; 13 7.62,-1.27; 14 7.62,1.27
ECX-53B = smd 1.6 x 1.25: 1 -1.85,-1.1; 2 1.85,-1.1; 3 1.85,1.1; 4 -1.85,1.1

### Placement (x,y rotation side)
C1  68.33,26.92 90 top
C2  48.26,19.56 180 top
C4  63.75,17.02 0 top
C5  50.04,33.02 90 top
C6  50.04,17.27 180 top
C7  10.67,21.59 90 top
C8  76.96,19.56 90 top
C9  65.02,35.31 90 top
C10  21.59,22.61 90 top
C11  32.26,35.31 180 top
C12  28.45,19.3 0 top
C13  27.94,9.4 90 top
C14  21.34,36.58 90 bottom
C17  66.55,23.37 180 bottom
C18  49.02,12.7 270 top
C22  58.42,5.33 270 top
C23  56.9,9.14 90 top
C24  51.56,12.7 270 top
C25  35.56,10.41 270 top
D2  83.06,29.97 270 bottom
D3  71.63,29.97 90 bottom
D4  17.27,30.23 270 bottom
D5  5.08,31.24 90 bottom
D8  33.02,5.33 0 top
IC1  57.15,37.34 0 top
IC3  31.75,9.14 180 top
IC4  61.72,29.72 90 bottom
IC5  27.43,29.97 270 bottom
IC7  29.72,27.43 270 top
IC8  51.05,5.59 90 top
JP1  26.67,37.34 270 top
JP2  14.48,18.29 90 top
JP3  6.86,18.29 90 top
JP4  81.28,17.02 90 top
JP5  72.39,17.02 90 top
L1  76.71,28.7 270 top
L2  10.92,30.48 270 top
L3  46.99,21.84 0 top
L4  70.87,27.43 270 top
L5  62.48,35.56 270 top
L6  41.91,11.68 270 top
LED1  68.33,39.37 0 top
R1  57.66,17.02 0 bottom
R2  57.66,19.3 0 bottom
R4  63.25,39.37 0 top
R7  13.72,21.84 0 top
R8  30.99,38.1 270 top
R9  7.11,22.1 180 top
R10  80.01,21.34 0 top
R11  73.66,21.34 180 top
R14  65.79,18.8 180 bottom
R15  35.05,18.8 0 top
R16  33.02,14.22 0 top
R17  29.21,14.22 0 top
U$1  57.4,25.65 45 top
U$2  -38.1,67.31 0 top  (outside the outline)
U$3  -66.04,-2.54 0 top  (outside the outline)
U$5  -40.64,67.31 0 top  (outside the outline)
U$6  10.41,2.54 0 top
U$7  76.45,2.54 0 top
X1  40.89,26.42 90 top
X5  23.37,18.29 0 top

### Tracks (layer width: path | path; a pad name or v marks a point on that pad's centre or on a via)
!INT  (1 unrouted)
!RX0BF  (1 unrouted)
!RX1BF  (1 unrouted)
+3V3  (via drill 0.7, 0.8)
  Top 0.254: v60.2,22.86 61.47,22.61 U$1.12 | X1.5 44.45,23.88 L3.B | L4.B 70.87,36.58 69.6,37.85 | 69.6,37.85 62.99,37.85 62.48,37.34 L5.B v60.2,37.34 57.66,37.34 57.15,37.85 IC1.5 | 69.6,37.85 69.6,39.3 LED1.ANODE
  Top 0.406: IC8.3 54.45,6.1 | 57.82,6.35 C22.1 | 35.05,35.31 35.05,33.48 IC7.18 | 35.05,35.31 v35.05,37.08 | 35.05,35.31 C11.1
  Top 0.508: 57.82,6.35 v56.39,6.35 54.22,6.35 IC8.3
  pour Bottom: -2.79,-3.56 163.07,-3.56 163.07,101.85 -2.79,101.85
+5V  (via drill 0.7)
  Top 0.254: v55.63,12.19 53.8,12.19 53.54,11.94 | v32.51,16.76 33.27,16.76 33.78,16.26 33.78,14.31 R16.2
  Top 0.406: R16.2 34.06,14.03 L6.2 42.29,13.65 C18.1 C24.1 53.54,13.65 53.54,11.94 53.54,8.5 IC8.4 | C23.1 54.75,8.38 IC8.4 | IC8.1 52.54,3.34 51.82,4.06 51.82,7.11 52.58,7.87 54.17,7.87 IC8.4
  Bottom 0.254: C17.1 65.7,23.28 60.71,18.29 60.71,14.73 58.17,12.19 v55.63,12.19 | IC5.8 27.43,33.78 28.45,32.77 28.45,28.19 29.21,27.43 34.29,27.43 35.05,26.67 35.05,24.64 34.29,23.88 33.02,23.88 32.51,23.37 v32.51,16.76
  Bottom 0.406: C17.1 65.7,25.08 IC4.8 | C14.1 21.34,34.29 21.84,33.78 IC5.8
+12V  (via drill 0.7)  (1 unrouted)
  Top 0.305: U$7.6 67.12,12.64 v67.06,12.7
  Top 0.406: 30.61,7.9 IC3.4
  Top 0.508: 30.61,7.9 C13.1 27.82,7.87 v24.38,7.87 | U$6.6 4.06,12.64 v4.06,12.7
  Bottom 0.305: v67.06,12.7 66.04,11.68 66.04,9.14 65.02,8.13 54.86,8.13 54.1,7.37 54.1,5.84 53.34,5.08 27.18,5.08 v24.38,7.87
  Bottom 0.508: v4.06,12.7 8.89,7.87 v24.38,7.87
CANH_2  (via drill 0.7)
  Top 0.508: R10.1 79.16,23.37 v81.53,23.37 | U$7.1 82.18,8.01 v84.07,9.91
  Top 0.61: L1.4 77.96,24.57 79.16,23.37
  Bottom 0.508: v84.07,9.91 84.07,13.46 85.34,14.73 85.34,19.56 v81.53,23.37
CANH_2_NF  (via drill 0.7)
  Top 0.61: L1.1 77.96,34.02 v78.99,35.05
  Bottom 0.61: IC4.7 67.82,28.45 69.85,29.97 80.87,29.97 D2.1 83.06,34.29 82.3,35.05 v78.99,35.05
CANH_A  (via drill 0.7)
  Top 0.406: U$6.1 13.85,8.01 v15.75,9.91 | v17.78,21.84 14.61,25.02 12.81,25.02 12.17,25.65 | 12.17,25.65 12.17,25.17 12.95,24.38 | 12.17,25.65 L2.4
  Top 0.508: 12.95,24.38 12.95,21.93 R7.1
  Bottom 0.406: v15.75,9.91 17.78,9.91 19.05,11.18 19.05,20.57 v17.78,21.84
CANH_A_NF  (via drill 0.7)
  Top 0.406: L2.1 12.17,35.03 v13.72,36.58
  Bottom 0.406: IC5.7 20.83,31.24 19.81,32.26 17.68,32.26 D4.1 | v13.72,36.58 15.75,36.58 17.27,35.05 D4.1 | D4.1 17.27,32
CANL_2  (via drill 0.7)
  Top 0.406: U$7.2 76.45,8.64 74.93,10.41 v69.85,10.41 | v68.83,20.57 71.37,23.11 74.57,23.11
  Top 0.508: 74.57,23.11 74.57,21.39 R11.1
  Top 0.61: L1.3 75.46,24.01 74.57,23.11
  Bottom 0.406: v69.85,10.41 68.83,11.68 v68.83,20.57
CANL_2_NF  (via drill 0.7)
  Top 0.61: L1.2 75.46,34.27 v74.68,35.05
  Bottom 0.61: v74.68,35.05 72.39,35.05 71.63,34.29 D3.2 70,32.41 68.07,30.99 IC4.6
CANL_A
  Top 0.406: 10.16,8.64 8.64,10.41 3.56,10.41 2.03,11.68 2.03,22.61 4.06,24.38 7.87,24.38 | 9.51,26.78 L2.3
  Top 0.508: 8.13,23.88 8.13,22.19 R9.1 | 8.13,23.88 8.13,25.4 9.51,26.78 | 10.16,8.64 U$6.2 | 7.87,24.38 8.13,23.88
CANL_A_NF  (via drill 0.7)
  Top 0.406: L2.2 9.67,34.78 v7.87,36.58
  Bottom 0.406: IC5.6 21.34,28.7 19.56,30.23 9.65,30.23 6.2,33.68 D5.2 5.33,33.93 5.33,35.81 6.1,36.58 v7.87,36.58
GND  (via drill 0.7, 0.8)  (5 unrouted)
  Bottom 0.305: v19.05,37.34 21.25,37.34 C14.2
  Bottom 0.406: 4.83,28.55 D5.1 | R2.C R1.C 54.58,15.52 v55.88,14.22 | C17.2 69.09,23.37 v69.85,24.13
  Bottom 0.61: v4.83,25.91 4.83,28.55 | v18.8,24.38 D4.2 18.69,27.79 20.32,26.16 IC5.5 IC5.4 | D3.1 71.63,25.91 v69.85,24.13 | D2.2 83.06,26.16 v84.84,24.38 | IC4.4 IC4.5 69.06,36.07 v69.34,36.07
  pour Top: -2.54,101.6 -3.81,101.6 -3.81,-2.54 163.32,-2.54 163.32,103.63 -2.54,103.63
GPIO34  (via drill 0.7)  (1 unrouted)
  Top 0.254: v58.17,14.73 57.4,15.49 53.59,15.49 52.58,16.51 52.58,18.29 52.58,18.54 53.97,19.68
  Bottom 0.305: v58.17,14.73 56.64,16.26 56.64,17.01 R1.A
JTAG_!TRST  (1 unrouted)
  Top 0.254: R15.2 X1.2
JTAG_TCK  (via drill 0.7)
  Top 0.254: U$1.57 49,29.46 49,30.25 v48.51,30.73
  Bottom 0.254: X1.9 X1.11 46.74,31.5 47.75,30.73 v48.51,30.73
JTAG_TDI  (via drill 0.7)
  Top 0.254: U$1.59 49.65,27.32 48.77,28.19 48.26,28.19 48.01,27.94 47.24,27.94 v46.74,27.43
  Bottom 0.254: v46.74,27.43 45.21,27.43 44.7,26.92 44.7,25.65 44.2,25.15 41.15,25.15 40.64,24.64 40.64,22.86 X1.3
JTAG_TDO  (via drill 0.7)
  Top 0.254: v55.88,21.84 52.58,25.18 U$1.58 50.05,27.67 48.51,29.21 v46.99,29.21
  Bottom 0.254: R2.A 56.63,21.09 v55.88,21.84 | v46.99,29.21 44.2,29.21 43.69,28.7 43.69,26.92 43.18,26.42 X1.7
JTAG_TMS  (via drill 0.7)
  Top 0.254: v47.5,25.65 48.07,25.65 U$1.60
  Bottom 0.254: X1.1 42.93,18.8 43.69,19.56 43.69,23.37 45.72,25.4 47.24,25.4 v47.5,25.65
LED0
  Top 0.254: 60.45,31.24 60.52,31.24 U$1.34
LED1
  Top 0.254: IC1.3 58.75,35.99 60.2,34.54 60.2,34.46 U$1.39
N$1  (via drill 0.7)
  Top 0.254: v63.2,18.8 U$1.9
  Bottom 0.254: v63.2,18.8 R14.1
N$2
  Top 0.254: C1.1 L4.A
  Top 0.305: C1.1 67.16,26.07 U$1.20
N$3
  Top 0.254: U$1.70 51.05,19.56 C2.1 49.02,20.83 L3.A
N$4
  Top 0.254: R4.1 58.78,39.37 IC1.4
N$5
  Top 0.254: U$1.72 51.05,18.29 C6.1
N$6
  Top 0.254: C5.1 50.13,30.46 U$1.54
N$7
  Top 0.254: U$1.7 60.83,19.68 61.72,18.8 61.72,17.53 62.23,17.02 C4.1
N$9
  Top 0.254: R4.2 LED1.CATHODE
N$10
  Top 0.254: C9.1 L5.A U$1.36
N$12
  Top 0.508: JP2.1 15.75,20.66 R7.2
N$13
  Top 0.508: JP3.2 5.59,21.42 R9.2
N$14
  Top 0.508: JP3.1 10.92,18.29 | 10.92,18.29 JP2.2 | C7.1 10.67,18.54 10.92,18.29
N$15
  Top 0.508: JP4.1 82.55,19.81 81.79,20.57 R10.2
N$16
  Top 0.508: R11.2 71.88,20.57 71.12,19.81 JP5.2
N$17
  Top 0.508: JP5.1 76.71,17.02 | 76.71,17.02 JP4.2 | C8.1 76.96,17.27 76.71,17.02
N$21
  Top 0.406: 35.56,7.87 35.56,7.33 35.02,6.79 D8.CATHODE | 35.56,7.87 C25.2 35.79,9.33 L6.1 42.64,9.33 | IC3.6 35.34,8.09 35.56,7.87
N$22
  Top 0.406: IC3.1 32.7,11.36 33.02,11.68 35.14,11.68 C25.1
N$24
  Top 0.406: 21.52,21.68 20.41,21.68 19.3,20.57 19.3,18.03 20.07,17.27 21.43,17.27 X5.1 | IC7.8 23.88,23.62 22.99,22.73 22.86,22.61 22.01,21.76 C10.1
  Top 0.61: 21.52,21.68 C10.1
N$25
  Top 0.406: X5.3 25.3,19.3 C12.1 27.43,19.47 27.43,24.38 26.92,24.89 IC7.7
RXCAN0  (via drill 0.7)
  Top 0.254: v59.94,28.45 59.94,29.96 U$1.33
  Bottom 0.254: IC4.2 v59.94,28.45
RXCAN1  (1 unrouted)
SHIELD  (via drill 0.7)
  Top 0.254: U$6.4 14.42,12.64 15.24,13.46 17.27,13.46 17.78,12.95 17.78,6.1 v20.57,3.3 | v81.79,11.68 80.77,12.7 79.51,12.7 U$7.4
  Bottom 0.254: v20.57,3.3 79.76,3.3 81.79,5.33 v81.79,11.68
SHIELD_GND  (via drill 0.7)
  Top 0.305: U$7.3 73.45,6.14 72.14,4.83 67.56,4.83 66.8,4.06 66.8,2.79 v65.79,1.78 | v7.11,3.3 7.11,7.96 U$6.3
  Bottom 0.305: v65.79,1.78 8.64,1.78 v7.11,3.3
TXCAN0  (via drill 0.7)
  Top 0.254: U$1.32 61.59,30.85 62.74,32 v63.5,32
  Bottom 0.254: v63.5,32 59.69,32 58.67,30.99 IC4.3
TXCAN1
  Top 0.305: IC7.1 25.02,33.65 25.4,34.04 JP1.1
TXCAN_NJ
  Top 0.305: R8.2 28.03,37.25 JP1.2
  Bottom 0.254: JP1.2 27.94,36.83 29.46,35.31 29.46,28.7
  Bottom 0.305: 29.46,28.7 IC5.3
VSENSE1
  Top 0.406: IC3.3 30.8,12 31.75,12.95 31.75,13.8 R16.1 R17.2

### Text on the board
tPlace: CAN-2==> | <==CAN-A